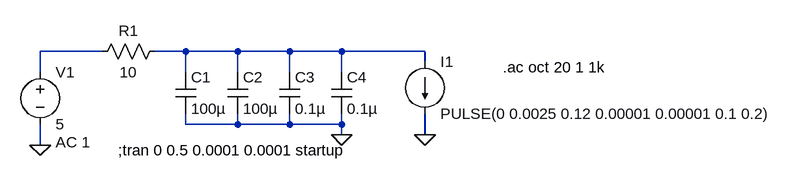
[diagram p0: schematic boardPS.asc]
boardPS.asc, the LTspice schematic file:
Version 4
SHEET 1 880 680
WIRE -448 -32 -544 -32
WIRE -320 -32 -368 -32
WIRE -240 -32 -320 -32
WIRE -160 -32 -240 -32
WIRE -80 -32 -160 -32
WIRE 48 -32 -80 -32
WIRE 48 -16 48 -32
WIRE -544 0 -544 -32
WIRE -320 0 -320 -32
WIRE -240 0 -240 -32
WIRE -160 0 -160 -32
WIRE -80 0 -80 -32
WIRE -320 80 -320 64
WIRE -240 80 -240 64
WIRE -240 80 -320 80
WIRE -160 80 -160 64
WIRE -160 80 -240 80
WIRE -80 80 -80 64
WIRE -80 80 -160 80
WIRE -80 96 -80 80
WIRE 48 96 48 64
WIRE -544 112 -544 80
FLAG -544 112 0
FLAG -80 96 0
FLAG 48 96 0
SYMBOL voltage -544 -16 R0
WINDOW 123 24 124 Left 2
WINDOW 39 0 0 Left 2
SYMATTR InstName V1
SYMATTR Value 5
SYMATTR Value2 AC 1
SYMBOL res -352 -48 R90
WINDOW 0 0 56 VBottom 2
WINDOW 3 32 56 VTop 2
SYMATTR InstName R1
SYMATTR Value 10
SYMBOL cap -336 0 R0
SYMATTR InstName C1
SYMATTR Value 100µ
SYMATTR SpiceLine Rser=0.2
SYMBOL cap -256 0 R0
SYMATTR InstName C2
SYMATTR Value 100µ
SYMATTR SpiceLine Rser=0.2
SYMBOL cap -176 0 R0
SYMATTR InstName C3
SYMATTR Value 0.1µ
SYMBOL cap -96 0 R0
SYMATTR InstName C4
SYMATTR Value 0.1µ
SYMBOL current 48 -16 R0
WINDOW 123 0 0 Left 2
WINDOW 39 0 0 Left 2
SYMATTR InstName I1
SYMATTR Value PULSE(0 0.0025 0.12 0.00001 0.00001 0.1 0.2)
TEXT -424 120 Left 2 !;tran 0 0.5 0.0001 0.0001 startup
TEXT 168 -8 Left 2 !.ac oct 20 1 1k

The netlist it stands for:
* boardPS.asc
V1 N001 0 5 AC 1
R1 N002 N001 10
C1 N002 0 100µ Rser=0.2
C2 N002 0 100µ Rser=0.2
C3 N002 0 0.1µ
C4 N002 0 0.1µ
I1 N002 0 PULSE(0 0.0025 0.12 0.00001 0.00001 0.1 0.2)
;tran 0 0.5 0.0001 0.0001 startup
.ac oct 20 1 1k
.backanno
.end